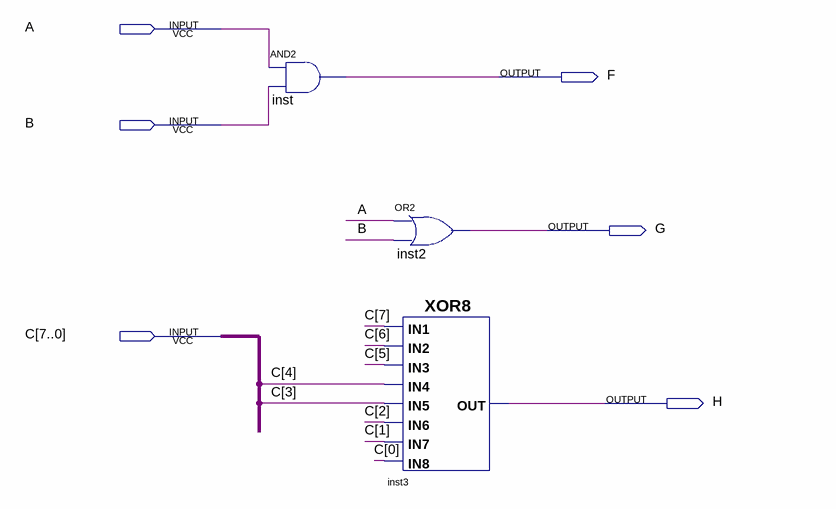
[diagram p0: schematic sheet]
// Quartus schematic proj1.bdf as structural Verilog: 3 symbols, 6 pins
module proj1 (
  input  A,
  input  B,
  input  [7:0] C,
  output F,
  output G,
  output H
);

  and inst (F, A, B);
  or inst2 (G, A, B);
  XOR8 inst3 (.IN8(C[0]), .IN1(C[7]), .IN7(C[1]), .IN6(C[2]), .IN5(C[3]), .IN4(C[4]), .IN3(C[5]), .IN2(C[6]), .OUT(H));
endmodule
